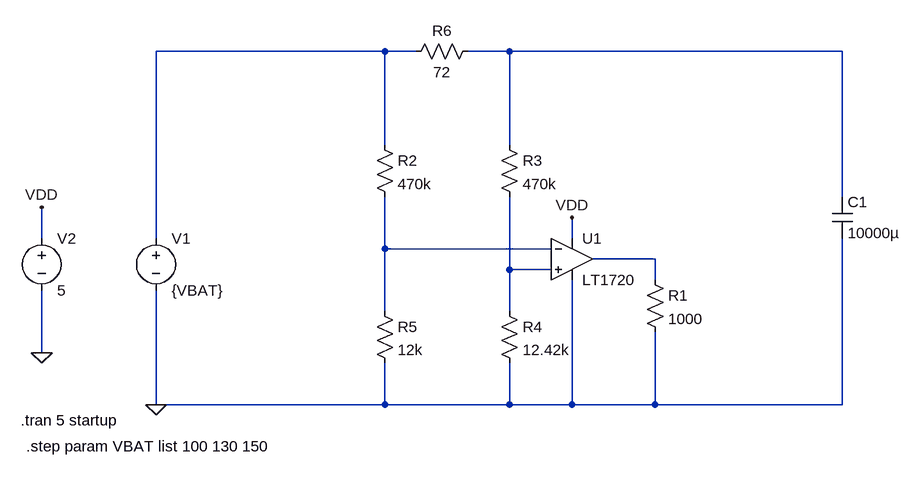
[diagram p0: schematic Comparator.asc]
Comparator.asc, the LTspice schematic file:
Version 4
SHEET 1 880 680
WIRE -32 -176 -384 -176
WIRE 16 -176 -32 -176
WIRE 160 -176 96 -176
WIRE 672 -176 160 -176
WIRE -32 -32 -32 -176
WIRE 160 -32 160 -176
WIRE 672 48 672 -176
WIRE -560 112 -560 64
WIRE -384 112 -384 -176
WIRE 256 112 256 80
WIRE -32 128 -32 48
WIRE 224 128 -32 128
WIRE 384 144 288 144
WIRE 160 160 160 48
WIRE 224 160 160 160
WIRE 384 176 384 144
WIRE -32 224 -32 128
WIRE 160 224 160 160
WIRE -560 288 -560 192
WIRE -384 368 -384 192
WIRE -32 368 -32 304
WIRE -32 368 -384 368
WIRE 160 368 160 304
WIRE 160 368 -32 368
WIRE 256 368 256 176
WIRE 256 368 160 368
WIRE 384 368 384 256
WIRE 384 368 256 368
WIRE 672 368 672 112
WIRE 672 368 384 368
FLAG -384 368 0
FLAG 256 80 VDD
FLAG -560 64 VDD
FLAG -560 288 0
SYMBOL Comparators\\LT1720 256 80 R0
SYMATTR InstName U1
SYMBOL res 368 160 R0
SYMATTR InstName R1
SYMATTR Value 1000
SYMBOL voltage -384 96 R0
WINDOW 123 0 0 Left 0
WINDOW 39 0 0 Left 0
SYMATTR InstName V1
SYMATTR Value {VBAT}
SYMBOL res -48 -48 R0
SYMATTR InstName R2
SYMATTR Value 470k
SYMBOL res 144 -48 R0
SYMATTR InstName R3
SYMATTR Value 470k
SYMBOL res -48 208 R0
SYMATTR InstName R5
SYMATTR Value 12k
SYMBOL res 144 208 R0
SYMATTR InstName R4
SYMATTR Value 12.42k
SYMBOL voltage -560 96 R0
WINDOW 123 0 0 Left 0
WINDOW 39 0 0 Left 0
SYMATTR InstName V2
SYMATTR Value 5
SYMBOL res 112 -192 R90
WINDOW 0 0 56 VBottom 2
WINDOW 3 32 56 VTop 2
SYMATTR InstName R6
SYMATTR Value 72
SYMBOL cap 656 48 R0
SYMATTR InstName C1
SYMATTR Value 10000µ
TEXT -592 392 Left 2 !.tran 5 startup
TEXT -584 432 Left 2 !.step param VBAT list 100 130 150

The netlist it stands for:
* Comparator.asc
XU1 N005 N003 VDD 0 N004 LT1720  ; pins In+ In- V+ V- OUT
R1 N004 0 1000
V1 N001 0 {VBAT}
R2 N001 N003 470k
R3 N002 N005 470k
R5 N003 0 12k
R4 N005 0 12.42k
V2 VDD 0 5
R6 N002 N001 72
C1 N002 0 10000µ
.tran 5 startup
.step param VBAT list 100 130 150
.lib LT1720.sub
.backanno
.end